# Altium schematic sheet WATER-PUMP .SchDoc
size A4; SheetNumber: 21; SheetTotal: 32
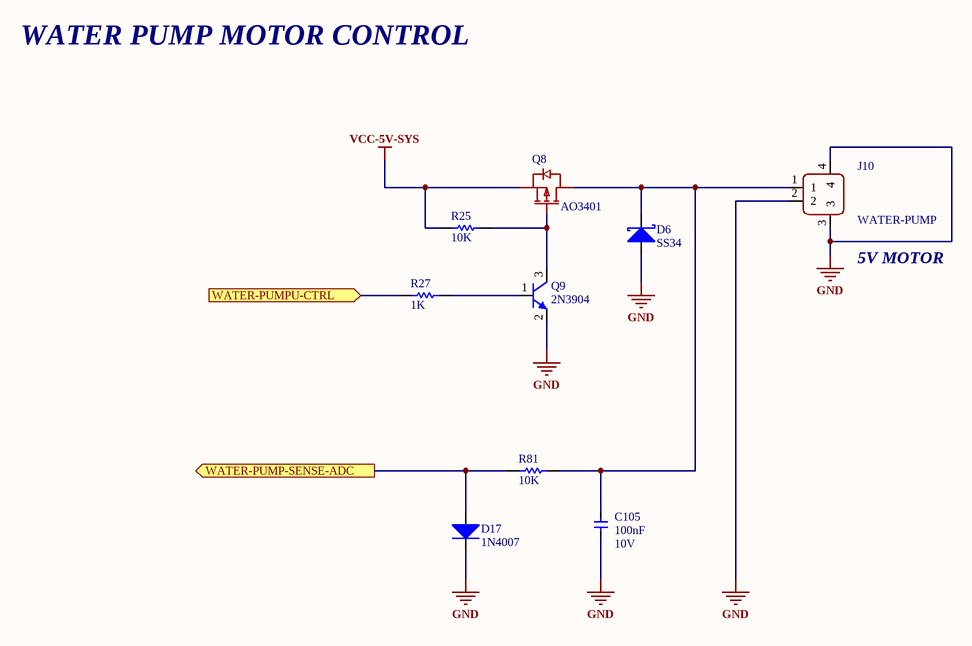
[diagram p0: WATER-PUMP .SchDoc]

## Parts
C105  100nF  VoltageRate: 10V  [CAP-0402]
D6  SS34  [SMA]
D17  1N4007  [SOD123]
J10  WATER-PUMP  [CONN-SMD_2P-P1.50_ZX-ZH1.5-2PWT]
Q8  AO3401  [SOT23-3D]
Q9  2N3904  [SOT23-3D]
R25  10K  [RES-0402]
R27  1K  [RES-0402]
R81  10K  [RES-0402]

## Ports
WATER-PUMP-SENSE-ADC (out, see Controller-RK3562-TOP[2B]), WATER-PUMPU-CTRL (in, see Controller-RK3562-TOP[2B])

## Nets
GND: C105.1 D6.1(A) D17.2(K) J10.2 J10.3 J10.4 Q9.2(E)
VCC-5V-SYS: Q8.2(S) R25.2
WATER-PUMP-SENSE-ADC: D17.1(A) R81.2 ; port WATER-PUMP-SENSE-ADC
WATER-PUMPU-CTRL: R27.2 ; port WATER-PUMPU-CTRL
NetC105_2: C105.2 D6.2(K) J10.1 Q8.3(D) R81.1
NetQ8_1: Q8.1(G) Q9.3(C) R25.1
NetQ9_1: Q9.1(B) R27.1

## Notes on the sheet
- WATER PUMP MOTOR CONTROL
- (near J10) 5V MOTOR

## Library data of the parts
C105 = Capacitor-1: ManufacturingPartNumber: *; Manufacturer: *; SupplierPartNumber: *; Supplier: *
D6 = DIODE-2: ManufacturingPartNumber: *; Manufacturer: *; SupplierPartNumber: *; Supplier: *; VoltageRate: *
D17 = DIODE-1: ManufacturingPartNumber: *; Manufacturer: *; SupplierPartNumber: *; Supplier: *; VoltageRate: *
J10 = HDRx2: ZX-ZH1.5-2PWT; ManufacturingPartNumber: *; Manufacturer: *; SupplierPartNumber: *; Supplier: *; VoltageRate: *
Q8 = P-MOS-SOT23: ManufacturingPartNumber: *; Manufacturer: *; SupplierPartNumber: *; Supplier: *; VoltageRate: *
Q9 = NPN-SOT23: ManufacturingPartNumber: *; Manufacturer: *; SupplierPartNumber: *; Supplier: *; VoltageRate: *
R25 R27 R81 = Resistor-1: ManufacturingPartNumber: *; Manufacturer: *; SupplierPartNumber: *; Supplier: *; VoltageRate: *